# Altium schematic sheet NE5532+TDA2030A.SchDoc
size 304 x 177 mm
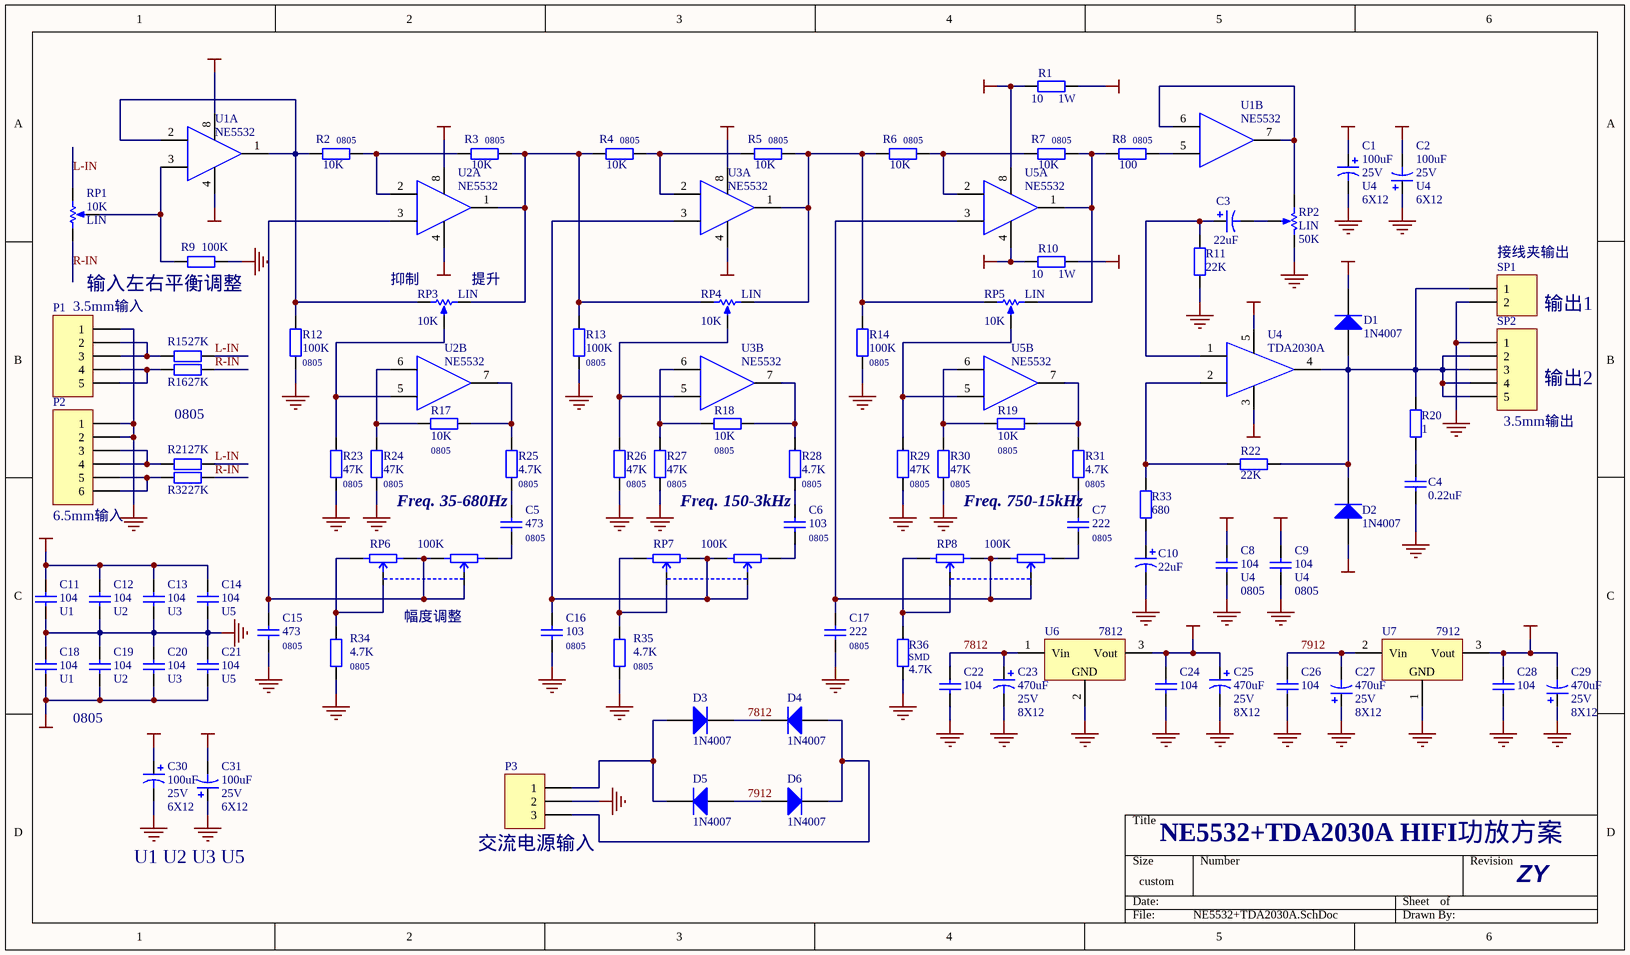
[diagram p0: NE5532+TDA2030A.SchDoc]

## Parts
C1  U4  value 100uF  Published: 25V  Publisher: 6X12  [C 6X12]
C2  U4  value 100uF  Published: 25V  Publisher: 6X12  [C 6X12]
C3  value 22uF  [c1206]  (hidden comment: Cap Pol1)
C4  value 0.22uF  [RAD-0.1]  (hidden comment: Cap)
C5  473  value 0805  [c0805]
C6  103  value 0805  [c0805]
C7  222  value 0805  [c0805]
C8  U4  value 104  Publisher: 0805  [c0805]
C9  U4  value 104  Publisher: 0805  [C0805]
C10  value 22uF  [c1206]  (hidden comment: Cap Pol1)
C11  U1  value 104  [C0805]
C12  U2  value 104  [C0805]
C13  U3  value 104  [C0805]
C14  U5  value 104  [C0805]
C15  473  value 0805  [c0805]
C16  103  value 0805  [c0805]
C17  222  value 0805  [c0805]
C18  U1  value 104  [C0805]
C19  U2  value 104  [C0805]
C20  U3  value 104  [C0805]
C21  U5  value 104  [C0805]
C22  value 104  [RAD-0.1]  (hidden comment: U4)
C23  25V  value 470uF  [C 8X12]
C24  value 104  [RAD-0.1]  (hidden comment: U4)
C25  25V  value 470uF  [C 8X12]
C26  value 104  [RAD-0.1]  (hidden comment: U4)
C27  25V  value 470uF  [C 8X12]
C28  value 104  [RAD-0.1]  (hidden comment: U4)
C29  25V  value 470uF  [C 8X12]
C30  25V  value 100uF  Publisher: 6X12  [C 6X12]
C31  25V  value 100uF  Publisher: 6X12  [C 6X12]
D1  1N4007  [DIO10.46-5.3x2.8]
D2  1N4007  [DIO10.46-5.3x2.8]
D3  1N4007  [DIO10.46-5.3x2.8]
D4  1N4007  [DIO10.46-5.3x2.8]
D5  1N4007  [DIO10.46-5.3x2.8]
D6  1N4007  [DIO10.46-5.3x2.8]
P1  Header 5  [3.5MM]  (value not drawn)
P2  Header 6  [6.5MM]  (value not drawn)
P3  Header 3  [h3]  (value not drawn)
R1  1W  value 10  [AXIAL-0.6]
R2  0805  value 10K  [R0805]
R3  0805  value 10K  [R0805]
R4  0805  value 10K  [R0805]
R5  0805  value 10K  [R0805]
R6  0805  value 10K  [R0805]
R7  0805  value 10K  [R0805]
R8  0805  value 100  [R0805]
R9  value 100K  [R0805]  (hidden comment: 0805)
R10  1W  value 10  [AXIAL-0.6]
R11  value 22K  [AXIAL-0.4]  (hidden comment: Res2)
R12  0805  value 100K  [R0805]
R13  0805  value 100K  [R0805]
R14  0805  value 100K  [R0805]
R15  value 27K  [R0805]  (hidden comment: 0805)
R16  value 27K  [R0805]  (hidden comment: 0805)
R17  0805  value 10K  [R0805]
R18  0805  value 10K  [R0805]
R19  0805  value 10K  [R0805]
R20  value 1  [AXIAL-0.4]  (hidden comment: Res2)
R21  value 27K  [R0805]  (hidden comment: 0805)
R22  value 22K  [AXIAL-0.4]  (hidden comment: Res2)
R23  0805  value 47K  [R0805]
R24  0805  value 47K  [R0805]
R25  0805  value 4.7K  [R0805]
R26  0805  value 47K  [R0805]
R27  0805  value 47K  [R0805]
R28  0805  value 4.7K  [R0805]
R29  0805  value 47K  [R0805]
R30  0805  value 47K  [R0805]
R31  0805  value 4.7K  [R0805]
R32  value 27K  [R0805]  (hidden comment: 0805)
R33  value 680  [AXIAL-0.4]  (hidden comment: Res2)
R34  0805  value 4.7K  [R0805]
R35  0805  value 4.7K  [R0805]
R36  SMD  value 4.7K  [R0805]
RP1  LIN  value 10K  [RP-1]
RP2  LIN  value 50K  [RP-1]
RP3  LIN  value 10K  [VR5]
RP4  LIN  value 10K  [VR5]
RP5  LIN  value 10K  [VR5]
RP6  100K  [RP-2]
RP7  100K  [RP-2]
RP8  100K  [RP-2]
SP1  Header 2  [H2]  (value not drawn)
SP2  Header 5  [3.5MM]  (value not drawn)
U1  NE5532  [DIP-8]  (parts A,B of 2)
U2  NE5532  [DIP-8]  (parts A,B of 2)
U3  NE5532  [DIP-8]  (parts A,B of 2)
U4  TDA2030A  [TDA2030]
U5  NE5532  [DIP-8]  (parts A,B of 2)
U6  7812  [TO-220]
U7  7912  [TO-220]

## Nets
+12V: C1.1 C8.1 C24.1 C25.1 D1.2(K) R1.2 U4.5 U6.3(Vout)
-12V: C2.2 C9.1 C28.1 C29.2 D2.1(A) R10.2 U4.3 U7.3(Vout)
GND: C1.2 C2.1 C4.2 C8.2 C9.2 C10.2 C11.1 C12.1 C13.1 C14.1 C15.1 C16.1 C17.1 C18.2 C19.2 C20.2 C21.2 C22.2 C23.2 C24.2 C25.2 C26.2 C27.1 C28.2 C29.1 C30.2 C31.1 P1.1 P2.1 P2.2 P3.2 R9.1 R11.1 R12.1 R13.1 R14.1 R23.1 R24.1 R26.1 R27.1 R29.1 R30.1 R34.2 R35.2 R36.2 RP2.1(TOP) SP1.2 SP2.1 U6.2(GND) U7.1(GND)
V+: C11.2 C12.2 C13.2 C14.2 C30.1 R1.1 U1.8(VCC+) U2.8(VCC+) U3.8(VCC+) U5.8(VCC+)
V-: C18.1 C19.1 C20.1 C21.1 C31.2 R10.1 U1.4(VCC-) U2.4(VCC-) U3.4(VCC-) U5.4(VCC-)
7812: C22.1 C23.1 D3.2(K) D4.2(K) U6.1(Vin)
7912: C26.1 C27.2 D5.1(A) D6.1(A) U7.2(Vin)
L-IN: R15.1 R21.1 RP1.2(BOT)
R-IN: R16.1 R32.1 RP1.1(TOP)
NetC3_1: C3.1 R11.2 U4.1
NetC3_2: C3.2 RP2.3(TAP)
NetC4_1: C4.1 R20.1
NetC5_1: C5.1 RP6.5
NetC5_2: C5.2 R25.2
NetC6_1: C6.1 RP7.5
NetC6_2: C6.2 R28.2
NetC7_1: C7.1 RP8.5
NetC7_2: C7.2 R31.2
NetC10_1: C10.1 R33.1
NetC15_2: C15.2 RP6.2 RP6.4 RP6.6 U2.3(IN+)
NetC16_2: C16.2 RP7.2 RP7.4 RP7.6 U3.3(IN+)
NetC17_2: C17.2 RP8.2 RP8.4 RP8.6 U5.3(IN+)
NetD1_1: D1.1(A) D2.2(K) R20.2 R22.1 SP1.1 SP2.2 SP2.3 SP2.4 SP2.5 U4.4
NetD3_1: D3.1(A) D5.2(K) P3.1
NetD4_1: D4.1(A) D6.2(K) P3.3
NetP1_2: P1.2 P1.3 R15.2
NetP1_4: P1.4 P1.5 R16.2
NetP2_3: P2.3 P2.4 R21.2
NetP2_5: P2.5 P2.6 R32.2
NetR2_1: R2.1 R12.2 RP3.1(TOP) U1.1(OUT1) U1.2(IN-)
NetR2_2: R2.2 R3.1 U2.2(IN-)
NetR3_2: R3.2 R4.1 R13.2 RP3.2(BOT) RP4.1(TOP) U2.1(OUT1)
NetR4_2: R4.2 R5.1 U3.2(IN-)
NetR5_2: R5.2 R6.1 R14.2 RP4.2(BOT) RP5.1(TOP) U3.1(OUT1)
NetR6_2: R6.2 R7.1 U5.2(IN-)
NetR7_2: R7.2 R8.1 RP5.2(BOT) U5.1(OUT1)
NetR8_2: R8.2 U1.5(IN+)
NetR9_2: R9.2 RP1.3(TAP) U1.3(IN+)
NetR17_1: R17.1 R25.1 U2.7(OUT2)
NetR17_2: R17.2 R24.2 U2.6(IN-)
NetR18_1: R18.1 R28.1 U3.7(OUT2)
NetR18_2: R18.2 R27.2 U3.6(IN-)
NetR19_1: R19.1 R31.1 U5.7(OUT2)
NetR19_2: R19.2 R30.2 U5.6(IN-)
NetR22_2: R22.2 R33.2 U4.2
NetR23_2: R23.2 RP3.3(TAP) U2.5(IN+)
NetR26_2: R26.2 RP4.3(TAP) U3.5(IN+)
NetR29_2: R29.2 RP5.3(TAP) U5.5(IN+)
NetR34_1: R34.1 RP6.1 RP6.3
NetR35_1: R35.1 RP7.1 RP7.3
NetR36_1: R36.1 RP8.1 RP8.3
NetRP2_2: RP2.2(BOT) U1.6(IN-) U1.7(OUT2)

## Notes on the sheet
- 输入左右平衡调整
- (near RP3) 抑制
- (near RP3) 提升
- (near SP1) 接线夹输出
- (near P1) 3.5mm输入
- 输出1
- 0805
- (near SP2) 3.5mm输出
- (near SP2) 输出2
- (near P2) 6.5mm输入
- (near C5) Freq. 35-680Hz
- (near C6) Freq. 150-3kHz
- (near C7) Freq. 750-15kHz
- (near RP6) 幅度调整
- NE5532+TDA2030A HIFI功放方案
- U1 U2 U3 U5
- (near P3) 交流电源输入
- ZY
- (in symbol Cap Pol1) 8X12

## Library data of the parts
C1-C3 C10 C23 C25 C27 C29-C31 = Cap Pol1: Polarized Capacitor (Radial); LatestRevisionDate: 17-Jul-2002; LatestRevisionNote: Re-released for DXP Platform.
  C3 C10 C23 C25 C27 C29: Published: 8-Jun-2000; Publisher: Altium Limited
  C30 C31: Published: 8-Jun-2000
C4-C9 C11-C22 C24 C26 C28 = Cap: Capacitor; Published: 8-Jun-2000; LatestRevisionDate: 17-Jul-2002; LatestRevisionNote: Re-released for DXP Platform.
  C4-C7 C11-C22 C24 C26 C28: Publisher: Altium Limited
D1-D6 = Diode 1N4007: 1 Amp General Purpose Rectifier; Published: 8-Jun-2000; LatestRevisionDate: 17-Jul-2002; LatestRevisionNote: Re-released for DXP Platform.; DatasheetDocument: 1998; PackageDocument: Aug-1999; PackageReference: DO-41; Publisher: Altium Limited; Code_JEDEC: DO-204-AL
P1 SP2 = Header 5: Header, 5-Pin; LatestRevisionDate: 17-Jul-2002; LatestRevisionNote: Re-released for DXP Platform.; Publisher: Altium Limited
P2 = Header 6: Header, 6-Pin; LatestRevisionDate: 17-Jul-2002; LatestRevisionNote: Re-released for DXP Platform.; Publisher: Altium Limited
P3 = Header 3: Header, 3-Pin; LatestRevisionDate: 17-Jul-2002; LatestRevisionNote: Re-released for DXP Platform.; Publisher: Altium Limited
R1-R36 = Res2: Resistor; Published: 8-Jun-2000; LatestRevisionDate: 17-Jul-2002; LatestRevisionNote: Re-released for DXP Platform.; Publisher: Altium Limited
RP1-RP5 = RPot: Potentiometer; Sim Note: Enter the Resistance value and the set point into parameter fields.; Set Position: 0.5; Published: 8-Jun-2000; LatestRevisionDate: 17-Jul-2002; LatestRevisionNote: Re-released for DXP Platform.; Publisher: Altium Limited
RP6-RP8 = RP-2
SP1 = Header 2: Header, 2-Pin; LatestRevisionDate: 17-Jul-2002; LatestRevisionNote: Re-released for DXP Platform.; Publisher: Altium Limited